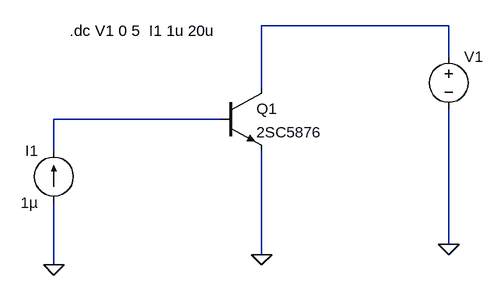
[diagram p0: schematic NPN_Ic_vs_Vce_trace.asc]
NPN_Ic_vs_Vce_trace.asc, the LTspice schematic file:
Version 4
SHEET 1 880 680
WIRE 624 224 336 224
WIRE 624 272 624 224
WIRE 336 320 336 224
WIRE 272 368 16 368
WIRE 16 416 16 368
WIRE 624 560 624 352
WIRE 336 576 336 416
WIRE 16 592 16 496
FLAG 336 576 0
FLAG 16 592 0
FLAG 624 560 0
SYMBOL npn 272 320 R0
SYMATTR InstName Q1
SYMATTR Value 2SC5876
SYMBOL voltage 624 256 R0
WINDOW 123 0 0 Left 2
WINDOW 39 0 0 Left 2
SYMATTR InstName V1
SYMATTR Value ""
SYMBOL current 16 496 R180
WINDOW 0 24 80 Left 2
WINDOW 3 24 0 Left 2
WINDOW 123 0 0 Left 2
WINDOW 39 0 0 Left 2
SYMATTR InstName I1
SYMATTR Value 1µ
TEXT 40 232 Left 2 !.dc V1 0 5  I1 1u 20u

The netlist it stands for:
* NPN_Ic_vs_Vce_trace.asc
Q1 N001 N002 0 0 2SC5876
V1 N001 0
I1 0 N002 1µ
.model NPN NPN
.model PNP PNP
.lib standard.bjt
.dc V1 0 5  I1 1u 20u
.backanno
.end